# Altium schematic sheet audio_interface.SchDoc
size A4
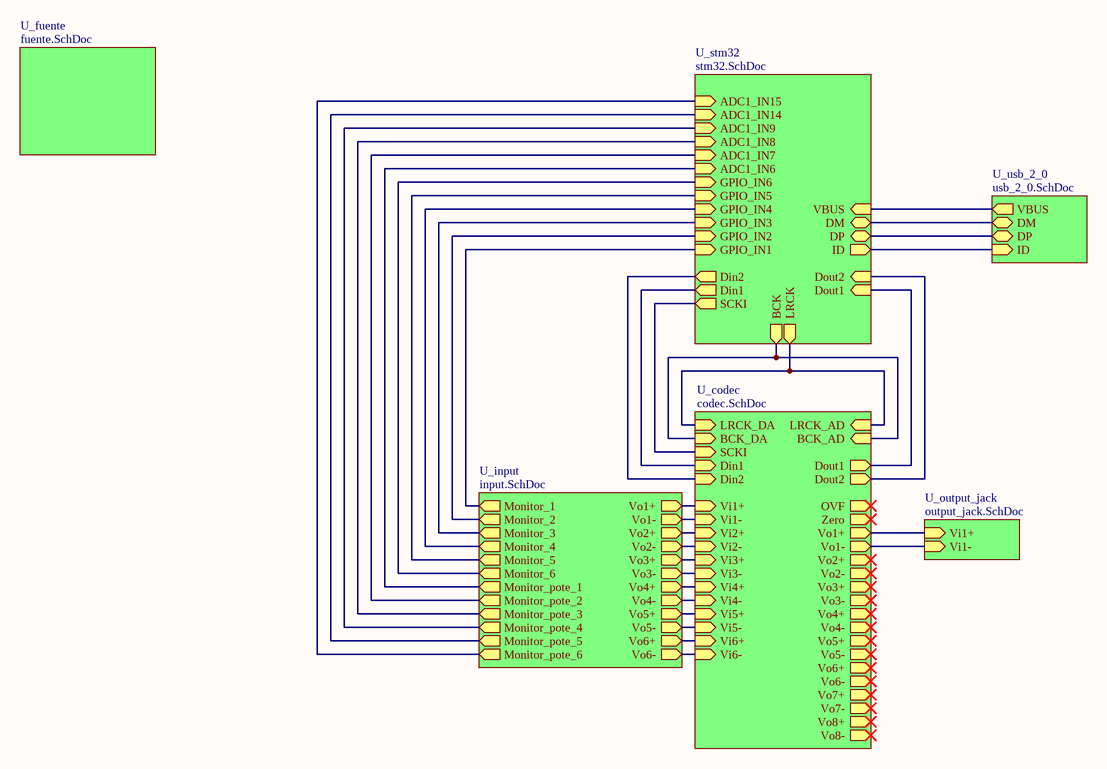
[diagram p0: audio_interface.SchDoc]

## Sub-sheets
U_codec = codec.SchDoc: OVF (out), Vo1+ (out), Zero (out), Vo1- (out), Vo2+ (out), Vo3+ (out), Vo2- (out), Vo3- (out), Vo4+ (out), Vo4- (out), Vo5+ (out), Vo5- (out), Vo6+ (out), Vo7+ (out), Vo6- (out), Vo7- (out), Vo8+ (out), Vo8- (out), Vi1+ (in), Vi1- (in), Vi2+ (in), Vi2- (in), Vi3+ (in), Vi3- (in), Vi4+ (in), Vi4- (in), Vi5+ (in), Vi5- (in), Vi6+ (in), Vi6- (in), Dout1 (out), Dout2 (out), LRCK_DA (in), BCK_DA (in), SCKI (in), Din1 (in), Din2 (in), LRCK_AD (in), BCK_AD (in)
U_fuente = fuente.SchDoc: no entries
U_input = input.SchDoc: Vo1+ (out), Vo1- (out), Vo2+ (out), Vo2- (out), Vo3+ (out), Vo3- (out), Vo4+ (out), Vo4- (out), Vo5+ (out), Vo5- (out), Vo6+ (out), Vo6- (out), Monitor_1 (out), Monitor_pote_5 (out), Monitor_pote_3 (out), Monitor_3 (out), Monitor_4 (out), Monitor_pote_6 (out), Monitor_2 (out), Monitor_6 (out), Monitor_pote_1 (out), Monitor_pote_4 (out), Monitor_pote_2 (out), Monitor_5 (out)
U_output_jack = output_jack.SchDoc: Vi1+ (in), Vi1- (in)
U_stm32 = stm32.SchDoc: Din1 (out), Dout1 (in), BCK (out), LRCK (out), SCKI (out), Din2 (out), Dout2 (in), VBUS (in), DM (bidir), ID (out), DP (bidir), GPIO_IN4 (in), GPIO_IN6 (in), GPIO_IN2 (in), ADC1_IN9 (in), ADC1_IN6 (in), GPIO_IN1 (in), GPIO_IN3 (in), ADC1_IN8 (in), ADC1_IN14 (in), GPIO_IN5 (in), ADC1_IN15 (in), ADC1_IN7 (in)
U_usb_2_0 = usb_2_0.SchDoc: ID (in), DM (bidir), DP (bidir), VBUS (out)

## Nets
(unnamed): sheet U_usb_2_0/ID, sheet U_stm32/ID
(unnamed): sheet U_usb_2_0/DM, sheet U_stm32/DM
(unnamed): sheet U_usb_2_0/DP, sheet U_stm32/DP
(unnamed): sheet U_usb_2_0/VBUS, sheet U_stm32/VBUS
(unnamed): sheet U_stm32/Din1, sheet U_codec/Din1
(unnamed): sheet U_stm32/Dout1, sheet U_codec/Dout1
(unnamed): sheet U_stm32/BCK, sheet U_codec/BCK_DA, sheet U_codec/BCK_AD
(unnamed): sheet U_stm32/LRCK, sheet U_codec/LRCK_DA, sheet U_codec/LRCK_AD
(unnamed): sheet U_stm32/SCKI, sheet U_codec/SCKI
(unnamed): sheet U_stm32/Din2, sheet U_codec/Din2
(unnamed): sheet U_stm32/Dout2, sheet U_codec/Dout2
(unnamed): sheet U_stm32/GPIO_IN4, sheet U_input/Monitor_4
(unnamed): sheet U_stm32/GPIO_IN6, sheet U_input/Monitor_6
(unnamed): sheet U_stm32/GPIO_IN2, sheet U_input/Monitor_2
(unnamed): sheet U_stm32/ADC1_IN9, sheet U_input/Monitor_pote_4
(unnamed): sheet U_stm32/ADC1_IN6, sheet U_input/Monitor_pote_1
(unnamed): sheet U_stm32/GPIO_IN1, sheet U_input/Monitor_1
(unnamed): sheet U_stm32/GPIO_IN3, sheet U_input/Monitor_3
(unnamed): sheet U_stm32/ADC1_IN8, sheet U_input/Monitor_pote_3
(unnamed): sheet U_stm32/ADC1_IN14, sheet U_input/Monitor_pote_5
(unnamed): sheet U_stm32/GPIO_IN5, sheet U_input/Monitor_5
(unnamed): sheet U_stm32/ADC1_IN15, sheet U_input/Monitor_pote_6
(unnamed): sheet U_stm32/ADC1_IN7, sheet U_input/Monitor_pote_2
(unnamed): sheet U_codec/Vo1+, sheet U_output_jack/Vi1+
(unnamed): sheet U_codec/Vo1-, sheet U_output_jack/Vi1-
(unnamed): sheet U_codec/Vi1+, sheet U_input/Vo1+
(unnamed): sheet U_codec/Vi1-, sheet U_input/Vo1-
(unnamed): sheet U_codec/Vi2+, sheet U_input/Vo2+
(unnamed): sheet U_codec/Vi2-, sheet U_input/Vo2-
(unnamed): sheet U_codec/Vi3+, sheet U_input/Vo3+
(unnamed): sheet U_codec/Vi3-, sheet U_input/Vo3-
(unnamed): sheet U_codec/Vi4+, sheet U_input/Vo4+
(unnamed): sheet U_codec/Vi4-, sheet U_input/Vo4-
(unnamed): sheet U_codec/Vi5+, sheet U_input/Vo5+
(unnamed): sheet U_codec/Vi5-, sheet U_input/Vo5-
(unnamed): sheet U_codec/Vi6+, sheet U_input/Vo6+
(unnamed): sheet U_codec/Vi6-, sheet U_input/Vo6-

## Notes on the sheet
- Title:
- Size:
- Author:
- A4
- Sheet
- of
- Revision:
- File:
- Date: